# Altium schematic sheet S7_Audio.SchDoc
size A3
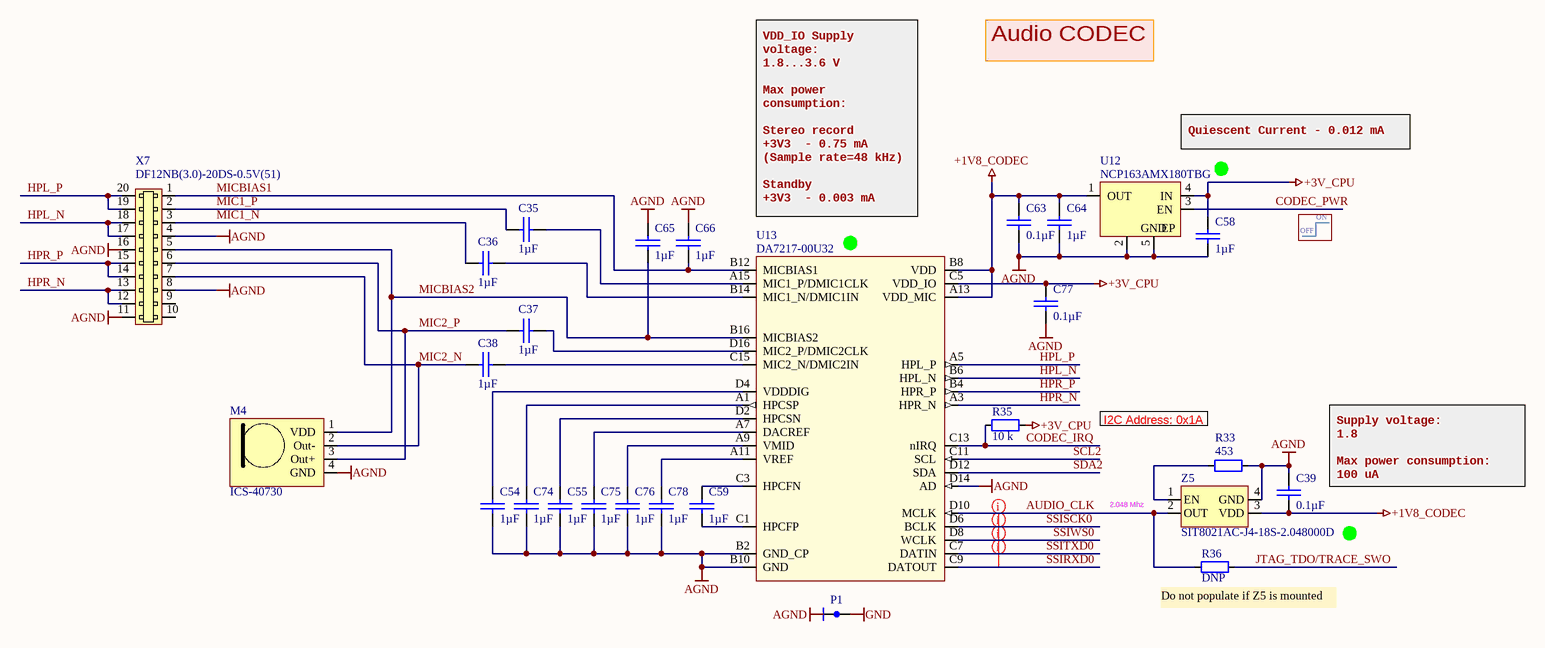
[diagram p0: S7_Audio.SchDoc]

## Parts
C35  value 1µF  [0402 CAP]  (hidden comment: TMK105BJ105MV-F)
C36  value 1µF  [0402 CAP]  (hidden comment: TMK105BJ105MV-F)
C37  value 1µF  [0402 CAP]  (hidden comment: TMK105BJ105MV-F)
C38  value 1µF  [0402 CAP]  (hidden comment: TMK105BJ105MV-F)
C39  value 0.1µF  [0402 CAP]  (hidden comment: 0402B104K500CT)
C54  value 1µF  [0402 CAP]  (hidden comment: TMK105BJ105MV-F)
C55  value 1µF  [0402 CAP]  (hidden comment: TMK105BJ105MV-F)
C58  value 1µF  [0402 CAP]  (hidden comment: TMK105BJ105MV-F)
C59  value 1µF  [0402 CAP]  (hidden comment: TMK105BJ105MV-F)
C63  value 0.1µF  [0402 CAP]  (hidden comment: 0402B104K500CT)
C64  value 1µF  [0402 CAP]  (hidden comment: TMK105BJ105MV-F)
C65  value 1µF  [0402 CAP]  (hidden comment: TMK105BJ105MV-F)
C66  value 1µF  [0402 CAP]  (hidden comment: TMK105BJ105MV-F)
C74  value 1µF  [0402 CAP]  (hidden comment: TMK105BJ105MV-F)
C75  value 1µF  [0402 CAP]  (hidden comment: TMK105BJ105MV-F)
C76  value 1µF  [0402 CAP]  (hidden comment: TMK105BJ105MV-F)
C77  value 0.1µF  [0402 CAP]  (hidden comment: 0402B104K500CT)
C78  value 1µF  [0402 CAP]  (hidden comment: TMK105BJ105MV-F)
M4  ICS-40730  [ICS-40730]
P1  Net tie 0.1mm  [Net tee 0.1 mm]  (value not drawn)  (net tie, no BOM)
R33  value 453  [0402]  (hidden comment: RMCF0402FT453R)
R35  value 10 k  [0402]  (hidden comment: RMCF0402FT10K0)
R36  value DNP  [0402]  (hidden comment: Resistor)  (no BOM)
U12  NCP163AMX180TBG  [4-XDFN]
U13  DA7217-00U32  [Dilaog 34-WLCSP (4.57x1.98)]
X7  DF12NB(3.0)-20DS-0.5V(51)  [DF12NB(3.0)-20DS-0.5V(51)]
Z5  SIT8021AC-J4-18S-2.048000D  [SiT8021]

## Nets
+1V8_CODEC: C39.2 C63.1 C64.1 U12.1(OUT) U13.A13(VDD_MIC) U13.B8(VDD) Z5.3(VDD)
+3V_CPU: C58.1 C77.1 R35.2 U12.4(IN) U13.C5(VDD_IO)
AGND: C39.1 C54.2 C55.2 C58.2 C63.2 C64.2 C65.1 C66.1 C74.2 C75.2 C76.2 C77.2 C78.2 M4.4(GND) P1.1 R33.1 U12.2(GND) U12.5(EP) U13.B2(GND_CP) U13.B10(GND) U13.D14(AD) X7.4 X7.8 X7.11 X7.16 Z5.4(GND)
GND: P1.2
AUDIO_CLK: R36.2 U13.D10(MCLK) Z5.2(OUT)
CODEC_IRQ: R35.1 U13.C13(nIRQ)
CODEC_PWR: U12.3(EN)
HPL_N: U13.B6(HPL_N) X7.17 X7.18
HPL_P: U13.A5(HPL_P) X7.19 X7.20
HPR_N: U13.A3(HPR_N) X7.12 X7.13
HPR_P: U13.B4(HPR_P) X7.14 X7.15
JTAG_TDO/TRACE_SWO: R36.1
MIC1_N: C36.1 X7.3
MIC1_P: C35.1 X7.2
MIC2_N: C38.1 M4.2(Out-) X7.7
MIC2_P: C37.1 M4.3(Out+) X7.6
MICBIAS1: C66.2 U13.B12(MICBIAS1) X7.1
MICBIAS2: C65.2 M4.1(VDD) U13.B16(MICBIAS2) X7.5
SCL2: U13.C11(SCL)
SDA2: U13.D12(SDA)
SSIRXD0: U13.C9(DATOUT)
SSISCK0: U13.D6(BCLK)
SSITXD0: U13.C7(DATIN)
SSIWS0: U13.D8(WCLK)
NetC35_2: C35.2 U13.A15(MIC1_P/DMIC1CLK)
NetC36_2: C36.2 U13.B14(MIC1_N/DMIC1IN)
NetC37_2: C37.2 U13.D16(MIC2_P/DMIC2CLK)
NetC38_2: C38.2 U13.C15(MIC2_N/DMIC2IN)
NetC54_1: C54.1 U13.D4(VDDDIG)
NetC55_1: C55.1 U13.D2(HPCSN)
NetC59_1: C59.1 U13.C3(HPCFN)
NetC59_2: C59.2 U13.C1(HPCFP)
NetC74_1: C74.1 U13.A1(HPCSP)
NetC75_1: C75.1 U13.A7(DACREF)
NetC76_1: C76.1 U13.A9(VMID)
NetC78_1: C78.1 U13.A11(VREF)
NetR33_2: R33.2 Z5.1(EN)

Not connected (* = marked no-connect by the designer): X7 9(5) 10(6)

## Layout directives
net class SSI: SSIRXD0, SSISCK0, SSITXD0, SSIWS0

## Notes on the sheet
- Audio CODEC
- (near U12) Quiescent Current - 0.012 mA
- VDD_IO Supply voltage:
  1.8...3.6 V
  Max power consumption:
  Stereo record
  +3V3  - 0.75 mA (Sample rate=48 kHz)
  Standby
  +3V3  - 0.003 mA
- OFF
- ON
- (near R33) I2C Address: 0x1A
- (near Z5) 2.048 Mhz
- (near C39) Supply voltage:
  1.8
  Max power consumption:
  100 uA
- (near R36) Do not populate if Z5 is mounted

## Library data of the parts
C35-C38 C54 C55 C58 C59 C64-C66 C74-C76 C78 = TMK105BJ105MV-F: 1µF, ±20%, 25V, X5R, 0402 (1005 Metric), -55°C ~ 85°C, -, General Purpose; Manufacturer: Taiyo Yuden; PartNum: 587-3245-1-ND; Voltage - Rated: 25V; Part Number: TMK105BJ105MV-F; Distributor: Digi-Key; PartName: TMK105BJ105MV-F; Price: 0.22000; Tolerance: ±20%; Temperature Coefficient: X5R; Operating Temperature: -55°C ~ 85°C; Features: -; Package / Case: 0402 (1005 Metric)
C39 C63 C77 = 0402B104K500CT: 0.1µF, ±10%, 50V, X7R, 0402 (1005 Metric), -55°C ~ 125°C, -, General Purpose; Manufacturer: Walsin Technology Corporation; PartNum: 1292-1176-1-ND; Voltage - Rated: 50V; Part Number: 0402B104K500CT; Distributor: Digi-Key; PartName: 0402B104K500CT; Price: 0.19000; Tolerance: ±10%; Temperature Coefficient: X7R; Operating Temperature: -55°C ~ 125°C; Features: -; Package / Case: 0402 (1005 Metric)
M4 = ICS-40730: 25Hz ~ 20kHz Analog Microphone MEMS (Silicon) 1.5V ~ 3.63V Noise Cancelling (-32dB ±2dB @ 124dB SPL) Solder Pads; Manufacturer: TDK InvenSense; PartNum: 1428-1141-1-ND; Distributor: Digi-Key; PartName: ICS-40730
R33 = RMCF0402FT453R: 453 Ohms, ±1%, 0.063W, 1/16W, Thick Film, ±100ppm/°C, 0402 (1005 Metric), -55°C ~ 155°C, Automotive AEC-Q200; Manufacturer: Stackpole Electronics Inc; PartNum: RMCF0402FT453RCT-ND; Voltage: 75V; Distributor: Digi-Key; Price: 0.10000; Tolerance: ±1%; PartName: RMCF0402FT453R; Part Number: RMCF0402FT453R; Temperature Coefficient: ±100ppm/°C; Operating Temperature: -55°C ~ 155°C; Power (Watts): 0.063W, 1/16W; Features: Automotive AEC-Q200; Package / Case: 0402 (1005 Metric)
R35 = RMCF0402FT10K0: 10 kOhms, ±1%, 0.063W, 1/16W, Thick Film, ±100ppm/°C, 0402 (1005 Metric), -55°C ~ 155°C, Automotive AEC-Q200; Manufacturer: Stackpole Electronics Inc; PartNum: RMCF0402FT10K0CT-ND; Voltage: 75V; Distributor: Digi-Key; Price: 0.10000; Tolerance: ±1%; PartName: RMCF0402FT10K0; Part Number: RMCF0402FT10K0; Temperature Coefficient: ±100ppm/°C; Operating Temperature: -55°C ~ 155°C; Power (Watts): 0.063W, 1/16W; Features: Automotive AEC-Q200; Package / Case: 0402 (1005 Metric)
R36 = RMCF0402FT10K0: Power (Watts): 0.063W, 1/16W; Distributor: Digi-Key; Package / Case: 0402 (1005 Metric)
U12 = NCP163AMX180TBG: LDO 1.8V, 250 mA, Vin < 5.5V, Iq < 20uA, -40..+125 C,  4-XDFN (1x1); Manufacturer: ON Semiconductor; PartNum: NCP163AMX180TBGOSCT-ND; Price: 0.29$; Distributor: Digi-Key; PartName: NCP163AMX180TBG
U13 = DA7217-00U32: Low power CODEC, 24 b, 2/2, I²C, I²S,  1.5V ~ 3.6V,  -25°C ~ 85°C, 34-WLCSP (4.57x1.98); Manufacturer: Dialog Semiconductor GmbH; PartNum: 1564-1043-1-ND; Price: 2.38$; Distributor: Digi-Key; PartName: DA7217-00U32
X7 = DF12NB(3.0)-20DS-0.5V(51): 20 Position Connector Receptacle, Center Strip Contacts Surface Mount Gold, height 2.2 mm, pitch 0.5 mm, Mated Stacking Heights 3mm; Manufacturer: Hirose Electric; PartNum: 26-DF12NB(3.0)-20DS-0.5V(51)CT-ND - Cut Tape (CT); Price: 064$; Distributor: Digi-Key; PartName: DF12NB(3.0)-20DS-0.5V(51)
Z5 = SIT8021AC-J4-18S-2.048000D: 2.048MHz XO (Standard) LVCMOS Oscillator 1.8V Standby (Power Down) 4-UFBGA, CSPBGA, -20...+70 C; Manufacturer: SiTIME; Distributor: Rochester Electronics; Price: 0.6$; PartNum: SIT8021AC-J4-18S-2.048000D; Value: 2.048MHz; PartName: SIT8021AC-J4-18S-2.048000D